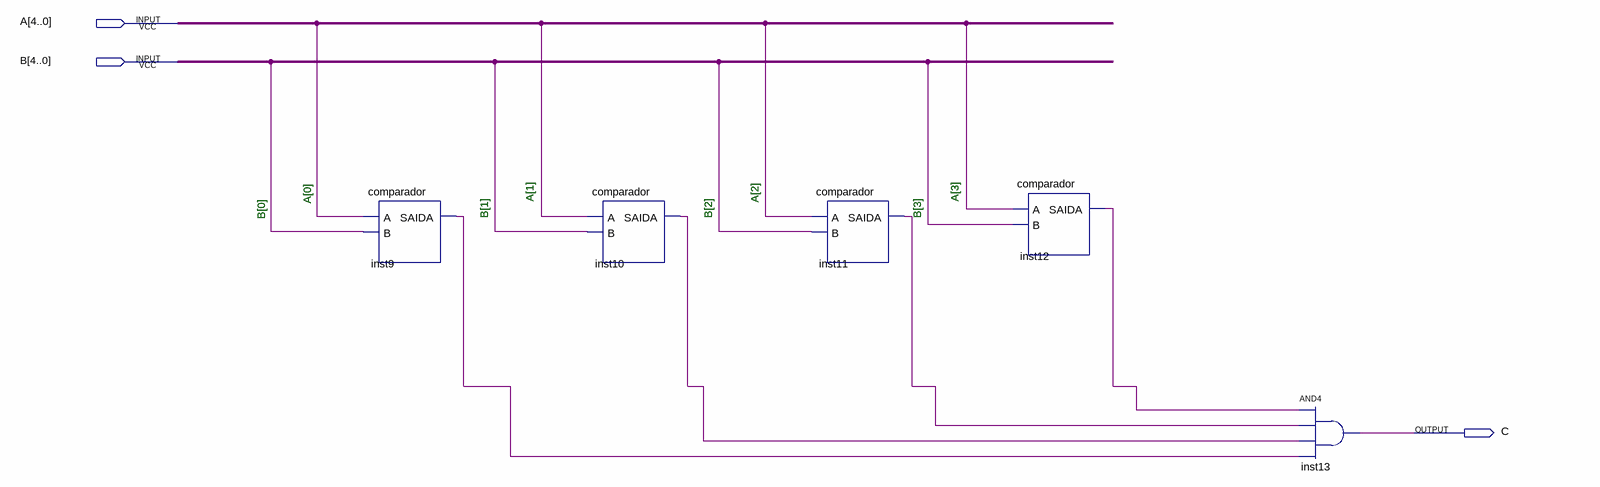
[diagram p0: schematic sheet]
// Quartus schematic ComparadorDoSomador.bdf as structural Verilog: 5 symbols, 3 pins
module ComparadorDoSomador (
  input  [4:0] A,
  input  [4:0] B,
  output C
);

  wire inst9_saida, inst10_saida, inst11_saida, inst12_saida;

  comparador inst9 (.A(A[0]), .B(B[0]), .SAIDA(inst9_saida));
  comparador inst10 (.A(A[1]), .B(B[1]), .SAIDA(inst10_saida));
  comparador inst11 (.A(A[2]), .B(B[2]), .SAIDA(inst11_saida));
  comparador inst12 (.A(A[3]), .B(B[3]), .SAIDA(inst12_saida));
  and inst13 (C, inst12_saida, inst11_saida, inst10_saida, inst9_saida);

  // Notes on the sheet:
  //   A[1]
  //   A[3]
  //   A[2]
  //   A[0]
  //   B[1]
  //   B[2]
  //   B[3]
  //   B[0]
endmodule
